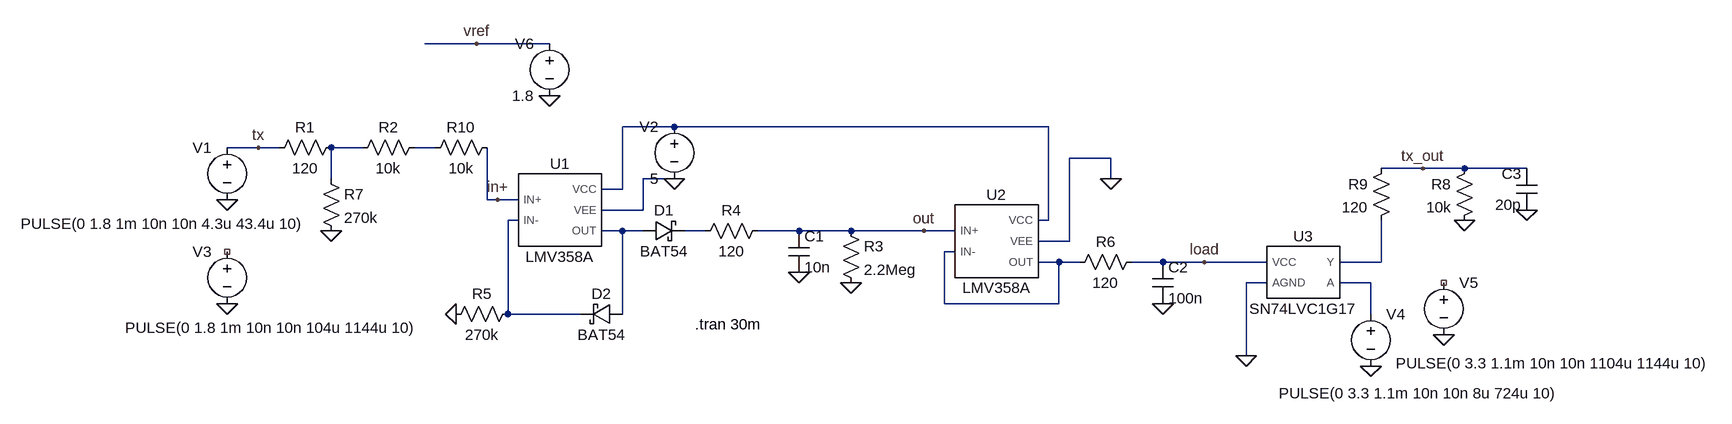
[diagram p0: schematic uart_ref11.asc]
uart_ref11.asc, the LTspice schematic file:
Version 4
SHEET 1 2940 756
WIRE 480 -16 400 -16
WIRE 592 -16 480 -16
WIRE 784 112 704 112
WIRE 1360 112 784 112
WIRE 144 144 96 144
WIRE 176 144 144 144
WIRE 304 144 256 144
WIRE 416 144 384 144
WIRE 1456 160 1392 160
WIRE 1936 176 1872 176
WIRE 2000 176 1936 176
WIRE 2096 176 2000 176
WIRE 256 192 256 144
WIRE 784 192 736 192
WIRE 1456 192 1456 160
WIRE 704 208 704 112
WIRE 704 208 672 208
WIRE 496 224 496 144
WIRE 512 224 496 224
WIRE 544 224 512 224
WIRE 736 240 736 192
WIRE 736 240 672 240
WIRE 544 256 528 256
WIRE 1360 256 1360 112
WIRE 1360 256 1344 256
WIRE 704 272 672 272
WIRE 736 272 704 272
WIRE 832 272 800 272
WIRE 976 272 912 272
WIRE 1056 272 976 272
WIRE 1168 272 1056 272
WIRE 1216 272 1168 272
WIRE 1392 288 1392 160
WIRE 1392 288 1344 288
WIRE 1216 304 1200 304
WIRE 1376 320 1344 320
WIRE 1408 320 1376 320
WIRE 1536 320 1488 320
WIRE 1600 320 1536 320
WIRE 1696 320 1600 320
WIRE 1872 320 1872 256
WIRE 1872 320 1808 320
WIRE 1696 352 1664 352
WIRE 1856 352 1808 352
WIRE 1200 384 1200 304
WIRE 1376 384 1376 320
WIRE 1376 384 1200 384
WIRE 528 400 528 256
WIRE 640 400 528 400
WIRE 704 400 704 272
WIRE 1856 400 1856 352
WIRE 1664 464 1664 352
FLAG 96 224 0
FLAG 144 144 tx
FLAG 976 336 0
FLAG 1056 352 0
FLAG 1168 272 out
FLAG 784 192 0
FLAG 1536 384 0
FLAG 1600 320 load
FLAG 1456 192 0
FLAG 448 400 0
FLAG 96 384 0
FLAG 1856 480 0
FLAG 1968 432 0
FLAG 2000 256 0
FLAG 2096 240 0
FLAG 1936 176 tx_out
FLAG 1664 464 0
FLAG 256 272 0
FLAG 592 64 0
FLAG 512 224 in+
FLAG 480 -16 vref
SYMBOL voltage 96 128 M0
WINDOW 123 0 0 Left 0
WINDOW 39 0 0 Left 0
WINDOW 3 -121 133 Left 2
SYMATTR InstName V1
SYMATTR Value PULSE(0 1.8 1m 10n 10n 4.3u 43.4u 10)
SYMBOL res 272 128 R90
WINDOW 0 0 56 VBottom 2
WINDOW 3 32 56 VTop 2
SYMATTR InstName R1
SYMATTR Value 120
SYMBOL res 400 128 R90
WINDOW 0 0 56 VBottom 2
WINDOW 3 32 56 VTop 2
SYMATTR InstName R2
SYMATTR Value 10k
SYMBOL schottky 736 288 R270
WINDOW 0 32 32 VTop 2
WINDOW 3 0 32 VBottom 2
SYMATTR InstName D1
SYMATTR Value BAT54
SYMATTR Description Diode
SYMATTR Type diode
SYMBOL cap 960 272 R0
SYMATTR InstName C1
SYMATTR Value 10n
SYMBOL res 1040 256 R0
SYMATTR InstName R3
SYMATTR Value 2.2Meg
SYMBOL AutoGenerated\\LMV358A 608 240 R0
SYMATTR InstName U1
SYMBOL voltage 784 96 M0
WINDOW 123 0 0 Left 0
WINDOW 39 0 0 Left 0
SYMATTR InstName V2
SYMATTR Value 5
SYMBOL res 928 256 R90
WINDOW 0 0 56 VBottom 2
WINDOW 3 32 56 VTop 2
SYMATTR InstName R4
SYMATTR Value 120
SYMBOL AutoGenerated\\LMV358A 1280 288 R0
SYMATTR InstName U2
SYMBOL res 1504 304 R90
WINDOW 0 0 56 VBottom 2
WINDOW 3 32 56 VTop 2
SYMATTR InstName R6
SYMATTR Value 120
SYMBOL cap 1520 320 R0
SYMATTR InstName C2
SYMATTR Value 100n
SYMBOL schottky 704 384 R90
WINDOW 0 0 32 VBottom 2
WINDOW 3 32 32 VTop 2
SYMATTR InstName D2
SYMATTR Value BAT54
SYMATTR Description Diode
SYMATTR Type diode
SYMBOL res 544 384 R90
WINDOW 0 0 56 VBottom 2
WINDOW 3 32 56 VTop 2
SYMATTR InstName R5
SYMATTR Value 270k
SYMBOL voltage 96 288 M0
WINDOW 123 0 0 Left 0
WINDOW 39 0 0 Left 0
WINDOW 3 -295 133 Left 2
SYMATTR InstName V3
SYMATTR Value PULSE(0 1.8 1m 10n 10n 104u 1144u 10)
SYMBOL AutoGenerated\\SN74LVC1G17 1760 336 M0
SYMATTR InstName U3
SYMBOL voltage 1856 384 R0
WINDOW 123 0 0 Left 0
WINDOW 39 0 0 Left 0
WINDOW 3 -142 138 Left 2
SYMATTR InstName V4
SYMATTR Value PULSE(0 3.3 1.1m 10n 10n 8u 724u 10)
SYMBOL voltage 1968 336 R0
WINDOW 123 0 0 Left 0
WINDOW 39 0 0 Left 0
WINDOW 3 -74 140 Left 2
SYMATTR InstName V5
SYMATTR Value PULSE(0 3.3 1.1m 10n 10n 1104u 1144u 10)
SYMBOL res 2016 160 M0
SYMATTR InstName R8
SYMATTR Value 10k
SYMBOL cap 2112 176 M0
SYMATTR InstName C3
SYMATTR Value 20p
SYMBOL res 1888 160 M0
SYMATTR InstName R9
SYMATTR Value 120
SYMBOL res 240 176 R0
SYMATTR InstName R7
SYMATTR Value 270k
SYMBOL res 512 128 R90
WINDOW 0 0 56 VBottom 2
WINDOW 3 32 56 VTop 2
SYMATTR InstName R10
SYMATTR Value 10k
SYMBOL voltage 592 -32 M0
WINDOW 123 0 0 Left 0
WINDOW 39 0 0 Left 0
SYMATTR InstName V6
SYMATTR Value 1.8
TEXT 816 416 Left 2 !.tran 30m

The netlist it stands for:
* uart_ref11.asc
V1 tx 0 PULSE(0 1.8 1m 10n 10n 4.3u 43.4u 10)
R1 N002 tx 120
R2 N003 N002 10k
D1 N005 N006 BAT54
C1 out 0 10n
R3 out 0 2.2Meg
XU1 in+ N004 N001 0 N005 LMV358A  ; pins IN+ IN- VCC VEE OUT
V2 N001 0 5
R4 out N006 120
XU2 out N007 N001 0 N007 LMV358A  ; pins IN+ IN- VCC VEE OUT
R6 load N007 120
C2 load 0 100n
D2 N005 N004 BAT54
R5 N004 0 270k
V3 NC_01 0 PULSE(0 1.8 1m 10n 10n 104u 1144u 10)
XU3 N008 N009 load 0 SN74LVC1G17  ; pins Y A VCC AGND
V4 N009 0 PULSE(0 3.3 1.1m 10n 10n 8u 724u 10)
V5 NC_02 0 PULSE(0 3.3 1.1m 10n 10n 1104u 1144u 10)
R8 tx_out 0 10k
C3 tx_out 0 20p
R9 tx_out N008 120
R7 N002 0 270k
R10 in+ N003 10k
V6 vref 0 1.8
.model D D
.lib standard.dio
.tran 30m
.lib lmv358a.lib
.lib SN74LVC1G17.cir
.backanno
.end